# Altium schematic sheet [MP] RS485.SchDoc
size 254 x 208 mm; SheetNumber: 5; SheetTotal: 8
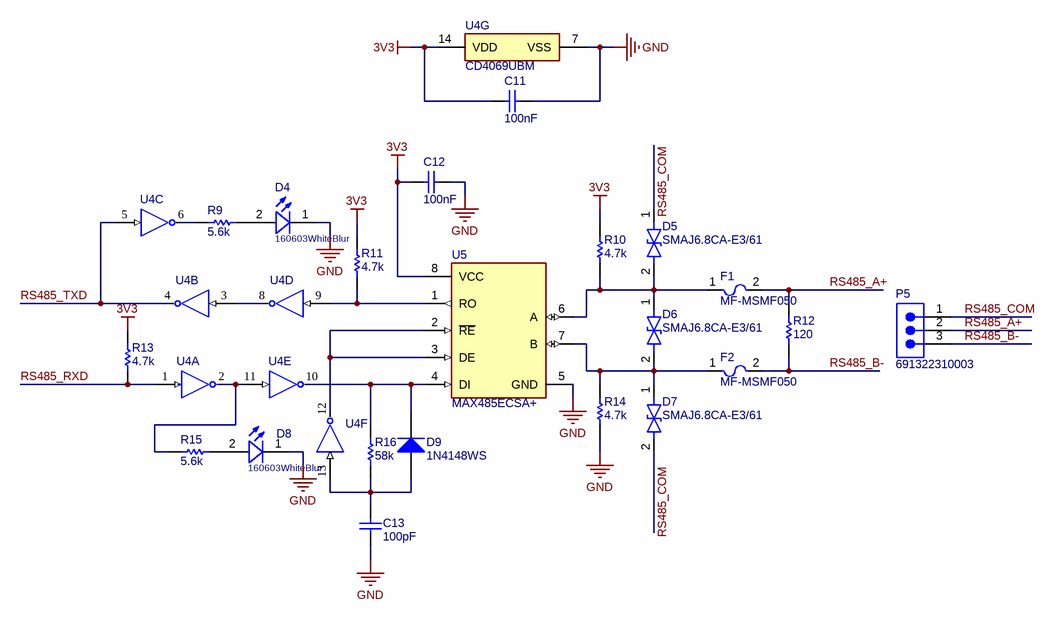
[diagram p0: [MP] RS485.SchDoc]

## Parts
C11  value 100nF  [CAP_0603]  (hidden comment: 0106031041050)
C12  value 100nF  [CAP_0603]  (hidden comment: 0106031041050)
C13  value 100pF  [CAP_0603]  (hidden comment: 0106031010550)
D4  160603WhiteBlur  [WL-SMCW_0603_H=0.7mm]
D5  SMAJ6.8CA-E3/61  [VISH-DO-214AC-2_M]
D6  SMAJ6.8CA-E3/61  [VISH-DO-214AC-2_M]
D7  SMAJ6.8CA-E3/61  [VISH-DO-214AC-2_M]
D8  160603WhiteBlur  [WL-SMCW_0603_H=0.7mm]
D9  1N4148WS  [FAIR-SOD-323_V]
F1  MF-MSMF050  [BOUR-MF-MSMF050-2_V]
F2  MF-MSMF050  [BOUR-MF-MSMF050-2_V]
P5  691322310003  [691322310003]
R9  value 5.6k  [RES_0603]  (hidden comment: 0006035621)
R10  value 4.7k  [RES_0603]  (hidden comment: 0006034721)
R11  value 4.7k  [RES_0603]  (hidden comment: 0006034721)
R12  value 120  [RES_0603]  (hidden comment: 0006031215)
R13  value 4.7k  [RES_0603]  (hidden comment: 0006034721)
R14  value 4.7k  [RES_0603]  (hidden comment: 0006034721)
R15  value 5.6k  [RES_0603]  (hidden comment: 0006035621)
R16  value 58k  [RES_0603]  (hidden comment: 0006035835)
U4  CD4069UBM  [FP-D0014A-MFG]  (value not drawn)  (parts A,B,C,D,E,F,G of 7)
U5  MAX485ECSA+  [FP-S8-5-MFG]

## Nets
3V3: C11.2 C12.2 R10.1 R11.1 R13.1 U4.14(VDD) U5.8(VCC)
GND: C11.1 C12.1 C13.1 D4.1(K) D8.1(K) R14.2 U4.7(VSS) U5.5(GND)
RS485_A+: F1.2 P5.2 R12.2
RS485_B-: F2.2 P5.3 R12.1
RS485_COM: D5.1(K) D7.2(A) P5.1
RS485_RXD: R13.2 U4.1(A)
RS485_TXD: U4.4(~{B}) U4.5(C)
NetC13_2: C13.2 D9.1(A) R16.1 U4.13(F)
NetD4_2: D4.2(A) R9.2
NetD5_2: D5.2(A) D6.1(K) F1.1 R10.2 U5.6(A)
NetD6_2: D6.2(A) D7.1(K) F2.1 R14.1 U5.7(B)
NetD8_2: D8.2(A) R15.2
NetD9_2: D9.2(K) R16.2 U4.10(~{E}) U5.4(DI)
NetR9_1: R9.1 U4.6(~{C})
NetR11_2: R11.2 U4.9(D) U5.1(RO)
NetR15_1: R15.1 U4.2(~{A}) U4.11(E)
NetU4_3: U4.3(B) U4.8(~{D})
NetU4_12: U4.12(~{F}) U5.2(~{RE}) U5.3(DE)

## Notes on the sheet
- Title
- Size
- Date:
- A4
- Number
- Check by:
- Revision
- Sheet of:
- Draw by:

## Library data of the parts
C11 C12 = CMP-001-00176-3: CAP, size 0603, 100 nF, 50 VDC, 10%; Manufacturer Part Number: CGA3E3X8R1H104K080AE; Manufacturer: TDK; Voltage Rating DC: 50 VDC; Source: Capacitor_0603_10_percent.SchLib; Operating Temperature Min: - 40 C; Supplier 3 URL: https://www.thegioiic.com/tu-gom-0603-100nf-0-1uf-50v; Supplier 1 Part Number: 810-CGA3E3X8R1H104KA; Mount: SMD/SMT; Supplier 1 URL: https://www.mouser.com/ProductDetail/TDK/CGA3E3X8R1H104K080AE?qs=nQSIdc08i%252Bd8g3IRRgU2bw%3D%3D&utm_source=mouser-refine-download&utm_medium=file&utm_campaign=CGA3E3X8R1H104K080AE&utm_content=TDK; Packaging: Tape and Reel; Supplier 3 Part Number: N/A; LCSC Part #: C14663; ComponentLink1Description: Datasheet; Operating Temperature Max: + 85 C; Design Item ID: 0106031041050; Supplier 2 URL: https://www.digikey.com/en/products/detail/tdk-corporation/cga3e3x8r1h104k080ae/5809262; Component Type: Standard; Supplier 2 Part Number: 445-173697-2-ND; Case/Package: 0603; Tolerance: 10%; ComponentLink1URL: https://product.tdk.com/system/files/dam/doc/product/capacitor/ceramic/mlcc/catalog/mlcc_automotive_soft_en.pdf?ref_disty=mouser; Pins: 2
C13 = CMP-001-00171-3: CAP, size 0603, 100 pF, 50 VDC, 5%; Manufacturer: TDK; Manufacturer Part Number: CGA3E2C0G1H101J080AA; Voltage Rating DC: 50 VDC; Operating Temperature Min: - 40 C; Supplier 1 Part Number: 810-CGA3E2C0G1H101J; Design Item ID: 0106031010550; Component Type: Standard; Mount: SMD/SMT; Supplier 2 Part Number: 445-5640-2-ND; ComponentLink1URL: https://product.tdk.com/system/files/dam/doc/product/capacitor/ceramic/mlcc/catalog/mlcc_automotive_general_en.pdf?ref_disty=mouser; Operating Temperature Max: + 85 C; Packaging: Tape and Reel; Case/Package: 0603; Supplier 3 Part Number: N/A; Supplier 1 URL: https://www.mouser.com/ProductDetail/TDK/CGA3E2C0G1H101J080AA?qs=FxQuwy19cyBF0gUakpLdHA%3D%3D&utm_source=mouser-refine-download&utm_medium=file&utm_campaign=CGA3E2C0G1H101J080AA&utm_content=TDK; Supplier 2 URL: https://www.digikey.com/en/products/detail/tdk-corporation/cga3e2c0g1h101j080aa/2443118; LCSC Part #: N/A; Source: Capacitor_0603_5_percent.SchLib; Tolerance: 5%; Pins: 2; Supplier 3 URL: N/A; ComponentLink1Description: Datasheet
D4 D8 = CMP-004-00039-2: WL-SMCW SMT Mono-color Chip LED Blur, size 0603, White; ComponentLink4URL: N/A; ComponentLink3Description: Supplier 2 URL; Pins: 2; ComponentLink2Description: Supplier 1 URL; ComponentLink2URL: https://www.mouser.vn/ProductDetail/ROHM-Semiconductor/SMLEN3WBC8W1?qs=W0yvOO0ixfGun78rr9Unsw%3D%3D; Supplier 3 URL: N/A; Design Item ID: 160603WhiteBlur; Type: Blur; Supplier 1 SN: 755-SMLEN3WBC8W1; Supplier 3 Name: ICDayRoi; Supplier 2 SN: 1516-1057-2-ND; Color: White; Supplier 1 Name: Mouser; ComponentLink1Description: Datasheet link; Component Type: Standard; ComponentLink4Description: Supplier 3 URL; Supplier 1 URL: https://www.mouser.vn/ProductDetail/ROHM-Semiconductor/SMLEN3WBC8W1?qs=W0yvOO0ixfGun78rr9Unsw%3D%3D; Supplier 2 Name: Digi-Key; ComponentLink1URL: N/A; ComponentLink3URL: https://www.digikey.com/en/products/detail/qt-brightek-qtb/QBLP601-IW/4814655; Supplier 2 URL: https://www.digikey.com/en/products/detail/qt-brightek-qtb/QBLP601-IW/4814655; Value: White; Source: WL-SMCW_0603.SchLib; Size: 0603; Supplier 3 SN: N/A
D5-D7 = CMP-004-00057-2: Trans Voltage Suppressor Diode, 400W, 6V V(RWM), Bidirectional, 1 Element, Silicon, DO-214AC; RoHS Compliant: Yes; Min Operating Temperature: -55°C; Pins: 2; Max Operating Temperature: 150°C
D9 = CMP-004-00001-3: Small Signal Diode, 75 V, 0.15 A, -55 to 150 degC, 2-Pin SOD-323, RoHS, Tape and Reel; Manufacturer: Fairchild; Peak Reverse Current: 5uA; Recovery Time: 4ns; Forward Voltage: 1V; Forward Current: 150mA; Capacitance: -323f; Package Description: 2-Pin Small Outline Diode Flat Lead, Body 1.7 x 1.25 mm; Datasheet URL: https://www.fairchildsemi.com/datasheets/1N/1N4148WS.pdf; Manufacturer URL: https://www.fairchildsemi.com/; Datasheet Version: Rev. 1.2, 03/2015; Package Reference: SOD-323; Max Operating Temperature: 150°C; Case/Package: SOD-323; Mounting Technology: SM; Package Quantity: 3000; Min Operating Temperature: -55°C; Pins: 2; Packaging: TapeandReel; RoHS Compliant: True
F1 F2 = CMP-005-00000-5: PTC Resettable Fuse, 15 V, 500 mA, -40 to 85 degC, 2-Pin SMD, RoHS, Tape and Reel; Manufacturer: Bourns; Current Rating: 100A; Package Description: 2-Pin Surface Mount Device, Body 4.55 x 3.24 mm; Max Operating Temperature: 85°C; Min Operating Temperature: -40°C; RoHS Compliant: False; Datasheet Version: Rev. AG, 08/2016; Datasheet URL: http://www.bourns.com/data/global/pdfs/mfmsmf.pdf; Packaging: TapeandReel; Mounting Technology: SM; Case/Package: MF-MSMF050-2; Package Reference: MF-MSMF050-2
P5 = CMP-002-00338-1: WR-TBL Series 322 Horizontal PCB Header, THT, pitch 3.81mm, 3p; Manufacturer: Wurth Elektronik; Modularity: No; Working Voltage: 300V; Rated Current: 10A; Value: 10A, 300V; Supplier 3 Part Number: N/A; Mount: Through Hole; Operating Temperature Max: 105°C; Operating Temperature Min: -40°C; Category: Terminal Blocks; Supplier 1 URL: N/A; Design Item ID: 691322310003; ComponentLink1URL: https://www.we-online.com/redexpert/spec/691322310003?ad; Number of Rows: 1; Supplier 3 URL: https://www.thegioiic.com/ul-3-81-3-r-terminal-block-plug-in-han-pcb-3-chan-cong-3-81mm-300v-10a-ulo; Component Type: Standard; Manufacturer Part Number: 691322310003; Orientation: Horizontal; Pin Count: 3; Pitch: 3.81mm; Source: Terminal_Blocks_Pluggable_3.81mm.SchLib; ComponentLink1Description: Datasheet; Supplier 2 URL: N/A; Supplier 1 Part Number: N/A; Supplier 2 Part Number: N/A; Pins: 3; Packaging: Box; Match Code: WR-TBL; Application: Pluggable
R9 R15 = CMP-009-00362-5: RES, size 0603, 5.6 KOhm, 1/10 W, 1%; Manufacturer Part Number: OEM; Rated Power: 1/10 W; Operating Temperature Max: + 85 C; Tolerance: 1%; Component Type: Standard; Source: Resistor_0603.SchLib; Design Item ID: 0006035621; Supplier 3 Part Number: N/A; Packaging: Tape and Reel; Supplier 1 Part Number: 667-ERJ-UP3F5601V; Manufacturer: OEM; Operating Temperature Min: - 40 C; Pins: 2; Supplier 3 URL: N/A; Supplier 1 URL: https://www.mouser.vn/ProductDetail/Panasonic/ERJ-UP3F5601V?qs=sGAEpiMZZMvdGkrng054twq3eZrCFN89ezYxgAsnxBTZYD17cS%252B65A%3D%3D; Supplier 2 Part Number: 10-ERJ-UP3F5601VTR-ND 10-ERJ-UP3F5601VCT-ND 10-ERJ-UP3F5601VDKR-ND; ComponentLink1Description: Datasheet; ComponentLink1URL: https://api.pim.na.industrial.panasonic.com/file_stream/main/fileversion/4484; Case/Package: 0603; LCSC Part #: N/A; Supplier 2 URL: https://www.digikey.com/en/products/detail/panasonic-electronic-components/ERJ-UP3F5601V/12092890; Mount: SMD/SMT
R10 R11 R13 R14 = CMP-009-00346-5: RES, size 0603, 4.7 kOhm, 1/10 W, 1%; Manufacturer Part Number: RC0603FR-074K7L; Manufacturer: YAGEO; Rated Power: 1/10 W; Design Item ID: 0006034721; Supplier 1 URL: https://www.mouser.vn/ProductDetail/YAGEO/RC0603FR-074K7L?qs=gt6vzsuosg37y0l7Vt36bQ%3D%3D; Source: Resistor_0603.SchLib; Supplier 2 URL: N/A; LCSC Part #: C99782; Supplier 2 Part Number: N/A; Supplier 1 Part Number: 603-RC0603FR-074K7L; Pins: 2; Packaging: Tape and Reel; ComponentLink1URL: https://www.mouser.vn/datasheet/2/447/YAGEO_PYu_RC_Group_51_RoHS_L_12-3313492.pdf; Supplier 3 Part Number: N/A; Component Type: Standard; Operating Temperature Max: + 85 C; Supplier 3 URL: N/A; Operating Temperature Min: - 40 C; Case/Package: 0603; ComponentLink1Description: Datasheet; Tolerance: 1%; Mount: SMD/SMT
R12 = CMP-009-00207-5: RES, size 0603, 120 Ohm, 1/10 W, 5%; Manufacturer Part Number: ERJ-PA3J121V; Manufacturer: Panasonic; Rated Power: 1/10 W; Supplier 1 Part Number: 667-ERJ-PA3J121V; Supplier 2 Part Number: P120BZTR-ND - Tape & Reel (TR); Operating Temperature Min: - 40 C; Supplier 2 URL: https://www.digikey.com/en/products/detail/panasonic-electronic-components/ERJ-PA3J121V/5035980?s=N4IgTCBcDaIGxwOwFoCiAlAUsgCgQQGZMBGMYgNRAF0BfIA; Source: Resistor_0603.SchLib; ComponentLink1Description: Datasheet; Packaging: Tape and Reel; Operating Temperature Max: + 85 C; Case/Package: 0603; Mount: SMD/SMT; Tolerance: 5%; Supplier 3 URL: https://www.thegioiic.com/dien-tro-120-ohm-0603-5; Pins: 2; Component Type: Standard; Supplier 3 Part Number: N/A; Design Item ID: 0006031215; Supplier 1 URL: https://www.mouser.vn/ProductDetail/Panasonic/ERJ-PA3J121V?qs=BzJM0faLVqUskHAfNBlRjA%3D%3D; ComponentLink1URL: https://www.mouser.vn/datasheet/2/315/AOA0000C331-1141874.pdf; LCSC Part #: N/A
R16 = CMP-009-00365-5: RES, size 0603, 58 KOhm, 1/10 W, 5%; Manufacturer: OEM; Rated Power: 1/10 W; Supplier 1 Part Number: N/A; Case/Package: 0603; Mount: SMD/SMT; Supplier 3 Part Number: N/A; ComponentLink1Description: Datasheet; Packaging: Tape and Reel; LCSC Part #: N/A; Supplier 3 URL: N/A; Source: Resistor_0603.SchLib; ComponentLink1URL: N/A; Supplier 1 URL: N/A; Pins: 2; Design Item ID: 0006035835; Supplier 2 URL: N/A; Component Type: Standard; Supplier 2 Part Number: N/A; Operating Temperature Max: + 85 C; Manufacturer Part Number: OEM; Operating Temperature Min: - 40 C; Tolerance: 5%
U4 = CMP-016-00018-2: Inverter, 4000/14000/40000 Series, 6-Func, 1-Input, CMOS, PDSO14; Max Supply Voltage: 18V; Min Supply Voltage: 3V; Nominal Supply Voltage: 5V; RoHS Compliant: Yes; Pins: 14; Min Operating Temperature: -55°C; Case/Package: SOP; Logic Type: INVERTER; Max Operating Temperature: 125°C
U5 = CMP-015-00010-1: Line Transceiver, 1 Func, 1 Driver, 1 Rcvr, CMOS, PDSO8; Nominal Supply Voltage: 5V; Min Supply Voltage: 4.75V; Max Supply Voltage: 5.25V; Pins: 8; Case/Package: SOP; Min Operating Temperature: 0°C; Max Operating Temperature: 70°C; RoHS Compliant: Yes